# EAGLE design Lemming v3 (EAGLE 9.6.2)
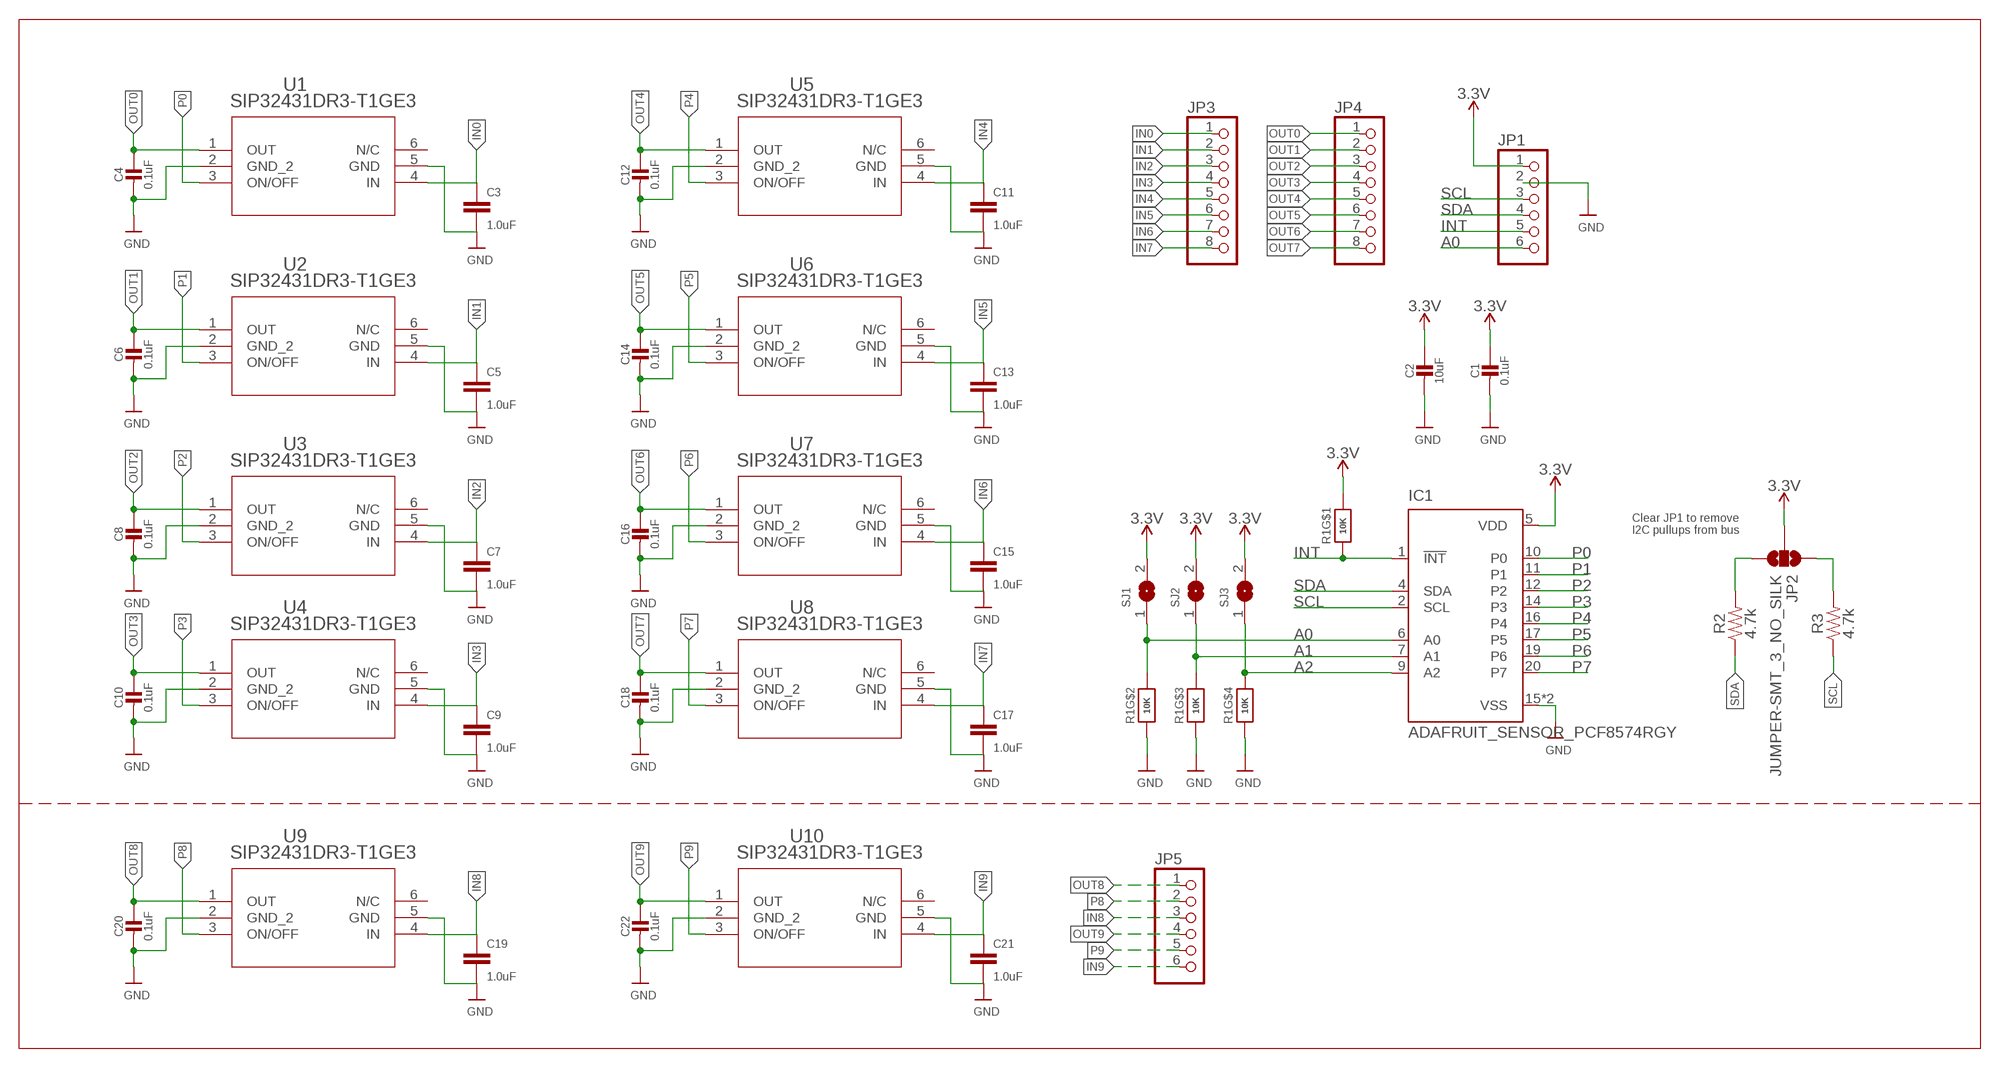
[diagram p0: schematic, sheet 1]

## Parts
C1  0.1uF  CAP_CERAMIC0603_NO  [0603-NO]
C2  10uF  CAP_CERAMIC0805-NOOUTLINE  [0805-NO]
C3  1.0uF  1.0UF-0603-16V-10%  [0603]
C4  0.1uF  CAP_CERAMIC0603_NO  [0603-NO]
C5  1.0uF  1.0UF-0603-16V-10%  [0603]
C6  0.1uF  CAP_CERAMIC0603_NO  [0603-NO]
C7  1.0uF  1.0UF-0603-16V-10%  [0603]
C8  0.1uF  CAP_CERAMIC0603_NO  [0603-NO]
C9  1.0uF  1.0UF-0603-16V-10%  [0603]
C10  0.1uF  CAP_CERAMIC0603_NO  [0603-NO]
C11  1.0uF  1.0UF-0603-16V-10%  [0603]
C12  0.1uF  CAP_CERAMIC0603_NO  [0603-NO]
C13  1.0uF  1.0UF-0603-16V-10%  [0603]
C14  0.1uF  CAP_CERAMIC0603_NO  [0603-NO]
C15  1.0uF  1.0UF-0603-16V-10%  [0603]
C16  0.1uF  CAP_CERAMIC0603_NO  [0603-NO]
C17  1.0uF  1.0UF-0603-16V-10%  [0603]
C18  0.1uF  CAP_CERAMIC0603_NO  [0603-NO]
C19  1.0uF  1.0UF-0603-16V-10%  [0603]
C20  0.1uF  CAP_CERAMIC0603_NO  [0603-NO]
C21  1.0uF  1.0UF-0603-16V-10%  [0603]
C22  0.1uF  CAP_CERAMIC0603_NO  [0603-NO]
IC1  ADAFRUIT_SENSOR_PCF8574RGY  [ADAFRUIT_SENSOR_VQFN20_3.5X4.5]
JP1  HEADER-1X670MIL  [1X06_ROUND_70]
JP2  JUMPER-SMT_3_NO_SILK  [SMT-JUMPER_3_NO_SILK]
JP3  PINHD-1X8BIG  [1X08-BIG]
JP4  PINHD-1X8BIG  [1X08-BIG]
JP5  HEADER-1X670MIL  [1X06_ROUND_70]
R1  10K  MICROBUILDER_RESISTOR_4PACK  [MICROBUILDER_RESPACK_4X0603]
R2  4.7k  4.7KOHM-0603-1/10W-1%  [0603]
R3  4.7k  4.7KOHM-0603-1/10W-1%  [0603]
SJ1  SOLDERJUMPER  [SOLDERJUMPER_ARROW_NOPASTE]
SJ2  SOLDERJUMPER  [SOLDERJUMPER_ARROW_NOPASTE]
SJ3  SOLDERJUMPER  [SOLDERJUMPER_ARROW_NOPASTE]
U1  SIP32431DR3-T1GE3  [SC-70-6_VIS]
U2  SIP32431DR3-T1GE3  [SC-70-6_VIS]
U3  SIP32431DR3-T1GE3  [SC-70-6_VIS]
U4  SIP32431DR3-T1GE3  [SC-70-6_VIS]
U5  SIP32431DR3-T1GE3  [SC-70-6_VIS]
U6  SIP32431DR3-T1GE3  [SC-70-6_VIS]
U7  SIP32431DR3-T1GE3  [SC-70-6_VIS]
U8  SIP32431DR3-T1GE3  [SC-70-6_VIS]
U9  SIP32431DR3-T1GE3  [SC-70-6_VIS]
U10  SIP32431DR3-T1GE3  [SC-70-6_VIS]

## Nets
3.3V: C1.1 C2.1 IC1.5(VDD) JP1.1 JP2.2 R1.8 SJ1.2 SJ2.2 SJ3.2
A0: IC1.6(A0) JP1.6 R1.7 SJ1.1
A1: IC1.7(A1) R1.6 SJ2.1
A2: IC1.9(A2) R1.5 SJ3.1
GND [highpower]: C1.2 C2.2 C3.2 C4.2 C5.2 C6.2 C7.2 C8.2 C9.2 C10.2 C11.2 C12.2 C13.2 C14.2 C15.2 C16.2 C17.2 C18.2 C19.2 C20.2 C21.2 C22.2 IC1.15(VSS) IC1.21(VSS) JP1.2 R1.2 R1.3 R1.4 U1.2(GND_2) U1.5(GND) U2.2(GND_2) U2.5(GND) U3.2(GND_2) U3.5(GND) U4.2(GND_2) U4.5(GND) U5.2(GND_2) U5.5(GND) U6.2(GND_2) U6.5(GND) U7.2(GND_2) U7.5(GND) U8.2(GND_2) U8.5(GND) U9.2(GND_2) U9.5(GND) U10.2(GND_2) U10.5(GND)
IN0: C3.1 JP3.1 U1.4(IN)
IN1: C5.1 JP3.2 U2.4(IN)
IN2: C7.1 JP3.3 U3.4(IN)
IN3: C9.1 JP3.4 U4.4(IN)
IN4: C11.1 JP3.5 U5.4(IN)
IN5: C13.1 JP3.6 U6.4(IN)
IN6: C15.1 JP3.7 U7.4(IN)
IN7: C17.1 JP3.8 U8.4(IN)
IN8: C19.1 JP5.3 U9.4(IN)
IN9: C21.1 JP5.6 U10.4(IN)
INT: IC1.1(!INT) JP1.5 R1.1
N$7: JP2.3 R2.2
N$8: JP2.1 R3.2
OUT0: C4.1 JP4.1 U1.1(OUT)
OUT1: C6.1 JP4.2 U2.1(OUT)
OUT2: C8.1 JP4.3 U3.1(OUT)
OUT3: C10.1 JP4.4 U4.1(OUT)
OUT4: C12.1 JP4.5 U5.1(OUT)
OUT5: C14.1 JP4.6 U6.1(OUT)
OUT6: C16.1 JP4.7 U7.1(OUT)
OUT7: C18.1 JP4.8 U8.1(OUT)
OUT8: C20.1 JP5.1 U9.1(OUT)
OUT9: C22.1 JP5.4 U10.1(OUT)
P0: IC1.10(P0) U1.3(ON/OFF)
P1: IC1.11(P1) U2.3(ON/OFF)
P2: IC1.12(P2) U3.3(ON/OFF)
P3: IC1.14(P3) U4.3(ON/OFF)
P4: IC1.16(P4) U5.3(ON/OFF)
P5: IC1.17(P5) U6.3(ON/OFF)
P6: IC1.19(P6) U7.3(ON/OFF)
P7: IC1.20(P7) U8.3(ON/OFF)
P8: JP5.2 U9.3(ON/OFF)
P9: JP5.5 U10.3(ON/OFF)
SCL: IC1.2(SCL) JP1.3 R3.1
SDA: IC1.4(SDA) JP1.4 R2.1
Unconnected: U1.6(N/C) U2.6(N/C) U3.6(N/C) U4.6(N/C) U5.6(N/C) U6.6(N/C) U7.6(N/C) U8.6(N/C) U9.6(N/C) U10.6(N/C)

## Notes on the sheet
- Clear JP1 to remove
  I2C pullups from bus

## Library data of the parts
C1 C2 C4 C6 C8 C10 C12 C14 C16 C18 C20 C22 = microbuilder:CAP_CERAMIC: Ceramic Capacitors For new designs, use the packages preceded by an '_' character since they are more reliable: The following footprints should be used on most boards: _0402 - Standard footprint for regular board layouts _0603 - Standard footprint for regular board layouts _0805 - Standard footprint for regular board layouts _1206 - Standard footprint for regular board layouts For extremely tight-pitch boards where space is at a premium, the following 'micro-pitch' footprints can be used (smaller pads, no silkscreen outline, etc.): _0402MP - Micro-pitch footprint for very dense/compact boards _0603MP - Micro-pitch footprint for very dense/compact boards _0805MP - Micro-pitch footprint for very dense/compact boards _1206MP - Micro-pitch footprint for very dense/compact boards
C3 C5 C7 C9 C11 C13 C15 C17 C19 C21 = SparkFun-Capacitors:1.0UF: 1µF ceramic capacitors A capacitor is a passive two-terminal electrical component used to store electrical energy temporarily in an electric field.; PROD_ID: CAP-00868
IC1 = Lemming v3:ADAFRUIT_SENSOR_PCF8574: I2C-Bus Remote 8-bit I/O expander http://www.semiconductors.philips.com/acrobat_download/datasheets/PCF8574_4.pdf
JP1 JP5 = microbuilder:HEADER-1X6: PIN HEADER
JP2 = SparkFun-Jumpers:JUMPER-SMT_3_NO: Normally open jumper This jumper has three pads in close proximity to each other. Apply solder to close the connection(s).
JP3 JP4 = adafruit:PINHD-1X8: PIN HEADER
R1 = Lemming v3:MICROBUILDER_RESISTOR_4PACK: Resistor Packs (4 resistors) 4 x 0603 10K 1/16W - Digikey: YC164J-10KCT-ND
R2 R3 = SparkFun-Resistors:4.7KOHM: 4.7kΩ resistor A resistor is a passive two-terminal electrical component that implements electrical resistance as a circuit element. Resistors act to reduce current flow, and, at the same time, act to lower voltage levels within circuits. - Wikipedia; PROD_ID: RES-07857
SJ1-SJ3 = microbuilder:SOLDERJUMPER: SMD Solder JUMPER Solder the two pads together to create a connection, or remove the solder to break it. REFLOW - Use this footprint for solder paste and reflow ovens. WAVE - Use this footprint for hand-soldering (larger pads). CLOSED - Has a trace between the two pads to ensure it is closed by default. The trace needs to be cut to disable the jumper, and can be closed again by creating a solder bridge between the two pads.; BOM: EXCLUDE
U1-U10 = Switch:SIP32431DR3-T1GE3; COPYRIGHT: Copyright (C) 2022 Ultra Librarian. All rights reserved.; MANUFACTURER_PART_NUMBER: SIP32431DR3-T1GE3; MFR_NAME: Vishay

## Net classes
1 highpower: width 0.305 mm, drill 0.483 mm

## Board
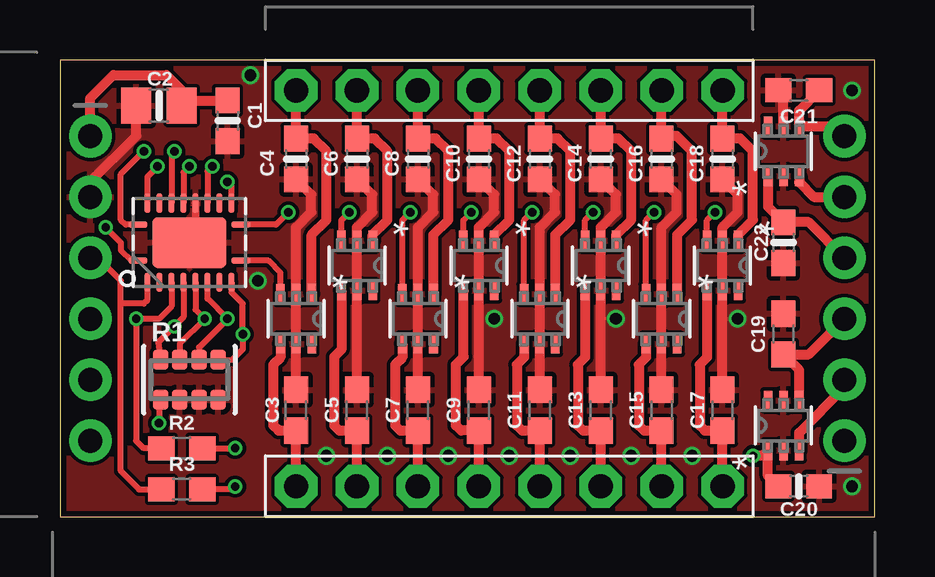
[diagram p1: board, top side]
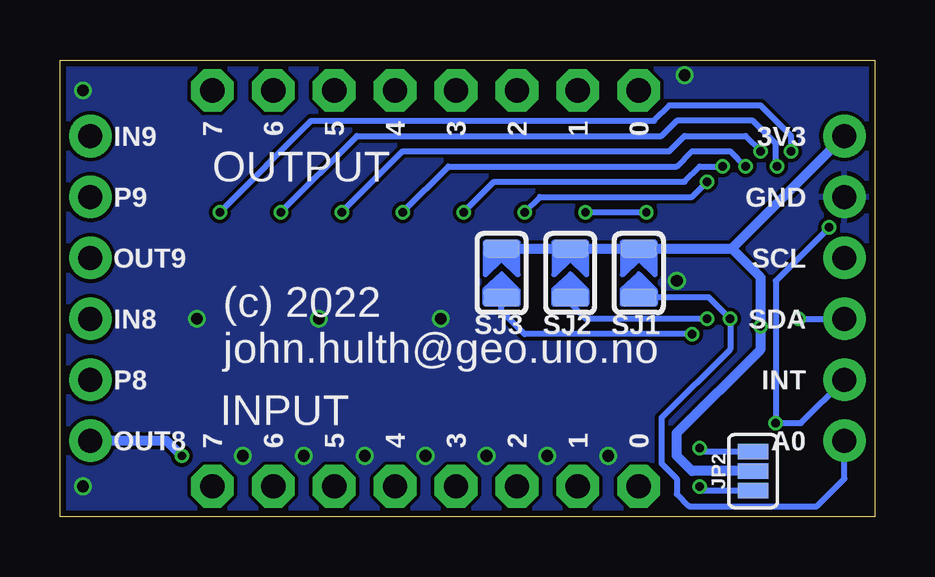
[diagram p2: board, bottom side, seen from below]

Size 33.97 x 19.05 mm. Coordinates in mm from the lower left corner, seen from the top.
Outline: 0,0 33.97,0 33.97,19.05 0,19.05 0,0
Copper layers (1*16): Top 0.018mm / dielectric 1.55mm / Bottom 0.018mm
Design rules "eC_2Layer_PClass6_BaseCopperO18_eCDefault": minimum track width 0.15mm, minimum drill 0.35mm, track to track 0.15mm, track to pad 0.15mm, pad to pad 0.15mm, via to via 0.15mm, smd to smd 0mil, copper to edge 0.25mm, drill to drill 0.35mm, minimum pad ring 0.175mm, minimum via ring 0.125mm, stop-mask expansion 0mil, vias tented up to drill 0.45mm, thermal gap 0.2mm

### Footprints (pad centres in the part's own frame; a part is rotated, then mirrored left to right if it is on the bottom)
0603-NO = smd 1.075 x 1: 1 -0.85,0; 2 0.85,0
0805-NO = smd 1.24 x 1.5: 1 -0.95,0; 2 0.95,0
0603 = smd 1.1 x 1: 1 -0.85,0; 2 0.85,0
ADAFRUIT_SENSOR_VQFN20_3.5X4.5 = smd 0.26 x 0.79: 1 -0.75,2.15; 10 -0.75,-2.15; 11 0.75,-2.15; 20 0.75,2.15 | smd 0.79 x 0.26: 2 -1.65,1.75; 3 -1.65,1.25; 4 -1.65,0.75; 5 -1.65,0.25; 6 -1.65,-0.25; 7 -1.65,-0.75; 8 -1.65,-1.25; 9 -1.65,-1.75; 12 1.65,-1.75; 13 1.65,-1.25; 14 1.65,-0.75; 15 1.65,-0.25; 16 1.65,0.25; 17 1.65,0.75; 18 1.65,1.25; 19 1.65,1.75 | smd 2.1 x 3.1: 21 0,0
1X06_ROUND_70 = drill 1 pad 1.778: 1 -6.35,0; 2 -3.81,0; 3 -1.27,0; 4 1.27,0; 5 3.81,0; 6 6.35,0
SMT-JUMPER_3_NO_SILK = smd 0.635 x 1.27: 1 -0.813,0; 2 0,0; 3 0.813,0
1X08-BIG = drill 1.016 pad 1.778 octagon: 1 -8.89,0; 2 -6.35,0; 3 -3.81,0; 4 -1.27,0; 5 1.27,0; 6 3.81,0; 7 6.35,0; 8 8.89,0
MICROBUILDER_RESPACK_4X0603 = smd 0.65 x 0.85: 1 -1.2,-0.835; 2 -0.4,-0.835; 3 0.4,-0.835; 4 1.2,-0.835; 5 1.2,0.835; 6 0.4,0.835; 7 -0.4,0.835; 8 -1.2,0.835
SOLDERJUMPER_ARROW_NOPASTE = smd 0.762 x 1.524: 1 -1.016,0; 2 1.016,0
SC-70-6_VIS = smd 0.813 x 0.356: 1 -1.041,0.65; 2 -1.041,0; 3 -1.041,-0.65; 4 1.041,-0.65; 5 1.041,0; 6 1.041,0.65

### Placement (x,y rotation side)
C1  6.99,16.51 270 top
C2  4.13,17.14 180 top
C3  9.84,4.45 90 top
C4  9.84,14.92 270 top
C5  12.38,4.45 90 top
C6  12.38,14.92 270 top
C7  14.92,4.45 90 top
C8  14.92,14.92 270 top
C9  17.46,4.45 90 top
C10  17.46,14.92 270 top
C11  20,4.45 90 top
C12  20,14.92 270 top
C13  22.54,4.45 90 top
C14  22.54,14.92 270 top
C15  25.08,4.45 90 top
C16  25.08,14.92 270 top
C17  27.62,4.45 90 top
C18  27.62,14.92 270 top
C19  30.16,7.62 90 top
C20  30.8,1.27 0 top
C21  30.8,17.78 180 top
C22  30.16,11.43 270 top
IC1  5.4,11.43 90 top
JP1  1.27,9.53 270 top
JP2  5.08,1.91 90 bottom
JP3  18.73,1.27 0 top
JP4  18.73,17.78 0 top
JP5  32.7,9.53 90 top
R1  5.4,5.71 0 top
R2  5.08,2.86 0 top
R3  5.08,1.14 0 top
SJ1  9.84,10.16 90 bottom
SJ2  12.7,10.16 90 bottom
SJ3  15.56,10.16 90 bottom
U1  9.84,8.26 270 top
U2  12.38,10.48 270 top
U3  14.92,8.26 270 top
U4  17.46,10.48 270 top
U5  20,8.26 270 top
U6  22.54,10.48 270 top
U7  25.08,8.26 270 top
U8  27.62,10.48 270 top
U9  30.16,3.81 90 top
U10  30.16,15.24 90 top

### Tracks (layer width: path | path; a pad name or v marks a point on that pad's centre or on a via)
3.3V  (via drill 0.35)
  Top 0.254: IC1.5 5.15,8.32 v4.76,7.94 4.1,7.27 R1.8
  Top 0.406: C2.1 5.29,17.36 | 5.29,17.36 C1.1 | JP1.1 1.27,17.46 2.22,18.41 4.45,18.41 5.29,17.57 5.29,17.36
  Bottom 0.406: JP2.2 7.62,1.91 8.26,2.54 8.26,3.49 4.76,6.99 v4.76,7.94 4.76,9.97 5.97,11.18 | SJ3.2 SJ2.2 SJ1.2 5.97,11.18 | 5.97,11.18 JP1.1
A0  (via drill 0.35)
  Top 0.254: IC1.6 5.65,8.64 v6.03,8.26 5,7.22 R1.7
  Bottom 0.254: SJ1.1 6.92,9.14 v6.03,8.26 6.03,6.99 8.89,4.13 8.89,2.22 8.26,1.59 8.26,0.95 7.74,0.44 2.42,0.44 1.27,1.59 JP1.6
A1  (via drill 0.35)
  Top 0.254: R1.6 5.8,7.07 v6.99,8.26 6.15,9.09 IC1.7
  Bottom 0.254: v6.99,8.26 12.06,8.26 12.7,8.89 SJ2.1
A2  (via drill 0.35)
  Top 0.254: IC1.9 7.15,9.36 7.62,8.89 v7.62,7.62 7.62,6.99 7.2,6.57 R1.5
  Bottom 0.254: v7.62,7.62 14.61,7.62 15.56,8.57 SJ3.1
GND  (via drill 0.48)
  Top 0.305: IC1.15 5.65,11.68 IC1.21
  Top 0.406: C10.2 18.1,13.44 18.1,12.7 17.46,12.06 U4.2 U4.5 C9.2 | C14.2 23.18,13.44 23.18,12.7 22.54,12.06 U6.2 U6.5 C13.2 | C18.2 28.26,13.44 28.26,12.7 27.62,12.06 U8.2 U8.5 C17.2 | C6.2 13.02,13.44 13.02,12.7 12.38,12.06 U2.2 U2.5 C5.2 | C15.2 U7.5 U7.2 25.08,12.06 25.72,12.7 25.72,13.44 C16.2 | C11.2 U5.5 U5.2 20,12.06 20.64,12.7 20.64,13.44 C12.2 | C7.2 U3.5 U3.2 14.92,12.06 15.56,12.7 15.56,13.44 C8.2 | C3.2 U1.5 U1.2 9.84,12.06 10.48,12.7 10.48,13.44 C4.2 | JP1.2 1.27,13.97 3.18,15.88 C2.2 | U10.5 30.16,17.57 C21.2
  other vias: 8.26,9.84 11.11,2.54 13.65,2.54 16.19,2.54 18.73,2.54 21.27,2.54 23.81,2.54 26.35,2.54 33.02,17.78 7.94,18.41 23.18,8.26 18.1,8.26 28.26,8.26 33.02,1.27
  pour Top: 0,0 0,19.68 33.97,19.68 33.97,0
  pour Bottom: 0,0 0,19.37 33.97,19.37 33.97,0
IN0
  Top 0.406: JP3.1 C3.1 9.11,3.6 8.89,3.81 8.89,6.35 9.19,6.65 U1.4
IN1
  Top 0.406: JP3.2 C5.1 11.64,3.6 11.43,3.81 11.43,6.67 11.73,6.97 U2.4
IN2
  Top 0.406: U3.4 14.27,6.65 13.97,6.35 13.97,3.81 14.19,3.6 C7.1 JP3.3
IN3
  Top 0.406: U4.4 16.83,9.42 16.83,6.67 16.51,6.35 16.51,3.81 16.73,3.6 C9.1 JP3.4
IN4
  Top 0.406: U5.4 19.35,6.65 19.05,6.35 19.05,3.81 19.27,3.6 C11.1 JP3.5
IN5
  Top 0.406: U6.4 21.89,6.65 21.59,6.35 21.59,3.81 21.8,3.6 C13.1 JP3.6
IN6
  Top 0.406: JP3.7 C15.1 24.34,3.6 24.13,3.81 24.13,6.35 24.43,6.65 U7.4
IN7
  Top 0.406: JP3.8 C17.1 26.89,3.6 26.67,3.81 26.67,6.35 26.97,6.65 U8.4
IN8
  Top 0.406: U9.4 30.81,6.12 C19.1 31.22,6.77 JP5.3
IN9
  Top 0.406: JP5.6 32.3,16.28 U10.4 30.81,16.95 C21.1
INT  (via drill 0.35)
  Top 0.254: v1.91,12.06 2.54,11.43 2.54,11.11 2.97,10.68 IC1.1 | R1.1 4.13,4.83 v4.13,3.91
  Bottom 0.254: v1.91,12.06 4.13,9.84 v4.13,3.91 3.08,3.91 JP1.5
N$7  (via drill 0.35)
  Top 0.254: R2.2 v7.3,2.86
  Bottom 0.254: v7.3,2.86 7.16,2.72 JP2.3
N$8  (via drill 0.35)
  Top 0.254: v7.3,1.25 7.19,1.14 R3.2
  Bottom 0.254: v7.3,1.25 7.14,1.09 JP2.1
OUT0
  Top 0.406: U1.1 10.49,11.76 11.11,12.38 11.11,15.24 10.58,15.77 C4.1 JP4.1
OUT1
  Top 0.406: JP4.2 C6.1 13.12,15.77 13.65,15.24 13.65,12.38 13.03,11.76 U2.1
OUT2
  Top 0.406: U3.1 15.57,11.76 16.19,12.38 16.19,15.24 15.66,15.77 C8.1 JP4.3
OUT3
  Top 0.406: U4.1 18.11,11.76 18.73,12.38 18.73,15.24 18.2,15.77 C10.1 JP4.4
OUT4
  Top 0.406: U5.1 20.65,11.76 21.27,12.38 21.27,15.24 20.74,15.77 C12.1 JP4.5
OUT5
  Top 0.406: U6.1 23.19,11.76 23.81,12.38 23.81,15.24 23.28,15.77 C14.1 JP4.6
OUT6
  Top 0.406: C16.1 25.08,15.88 | 25.08,15.88 JP4.7 | U7.1 25.73,11.76 26.35,12.38 26.35,15.24 25.72,15.88 25.08,15.88
OUT7
  Top 0.406: JP4.8 C18.1 28.36,15.77 28.89,15.24 28.89,12.38 28.27,11.76 U8.1
OUT8  (via drill 0.35)
  Top 0.406: C20.1 29.51,1.71 U9.1 29.28,2.54 v28.89,2.54
  Bottom 0.406: v28.89,2.54 29.53,3.17 JP5.1
OUT9
  Top 0.406: U10.1 29.51,12.93 C22.1 31.22,12.28 JP5.4
P0
  Top 0.254: U1.3 9.19,10.18 8.69,10.68 IC1.10
P1  (via drill 0.35)
  Top 0.254: U2.3 11.73,12.37 v12.06,12.7 | v9.53,12.7 9.01,12.18 IC1.11
  Bottom 0.254: v12.06,12.7 v9.53,12.7
P2  (via drill 0.35)
  Top 0.254: U3.3 14.27,12.37 v14.61,12.7 | IC1.12 7.15,13.81 v6.99,13.97
  Bottom 0.254: v14.61,12.7 13.97,13.34 7.62,13.34 v6.99,13.97
P3  (via drill 0.35)
  Top 0.254: U4.3 16.81,12.37 v17.14,12.7 | v6.35,14.61 6.15,14.4 IC1.14
  Bottom 0.254: v17.14,12.7 15.88,13.97 7.94,13.97 7.3,14.61 v6.35,14.61
P4  (via drill 0.35)
  Top 0.254: U5.3 19.35,12.37 v19.68,12.7 | v5.4,14.61 5.15,14.36 IC1.16
  Bottom 0.254: v19.68,12.7 17.78,14.61 8.26,14.61 7.62,15.24 6.03,15.24 v5.4,14.61
P5  (via drill 0.35)
  Top 0.254: U6.3 21.89,12.37 v22.23,12.7 | v4.76,15.24 4.65,15.12 IC1.17
  Bottom 0.254: v22.23,12.7 19.68,15.24 8.57,15.24 7.94,15.88 5.4,15.88 v4.76,15.24
P6  (via drill 0.35)
  Top 0.254: U7.3 24.43,12.37 v24.77,12.7 | IC1.19 3.65,14.18 v4.07,14.61
  Bottom 0.254: v24.77,12.7 21.59,15.88 8.89,15.88 8.26,16.51 5.08,16.51 4.13,15.56 4.13,14.66 v4.07,14.61
P7  (via drill 0.35)
  Top 0.254: U8.3 26.97,12.37 v27.3,12.7 | IC1.20 2.74,12.18 2.54,12.38 2.54,14.29 v3.49,15.24
  Bottom 0.254: v27.3,12.7 23.5,16.51 9.21,16.51 8.57,17.14 4.76,17.14 3.49,15.88 v3.49,15.24
P8
  Top 0.406: U9.3 30.81,3.51 32.7,5.4 JP5.2
P9
  Top 0.406: U10.3 30.81,13.96 31.43,13.34 JP5.5
SCL
  Top 0.254: JP1.3 1.59,10.79 2.54,9.84 2.54,8.89 | IC1.2 3.65,9.04 3.49,8.89 2.54,8.89 | 2.54,8.89 2.54,1.91 3.3,1.14 R3.1
SDA  (via drill 0.35)
  Top 0.254: IC1.4 4.65,8.78 4.13,8.26 v3.17,8.26 3.17,3.17 3.49,2.86 R2.1
  Bottom 0.254: v3.17,8.26 JP1.4

### Text on the board
bPlace: 3V3 | 0 | 1 | 2 | 3 | 4 | 5 | 6 | 7 | IN9 | OUTPUT | GND | P9 | SCL | OUT9 | SDA | IN8 | INT | (c) 2022 / john.hulth@geo.uio.no | P8 | INPUT | A0 | 0 | 1 | 2 | 3 | 4 | 5 | 6 | 7 | OUT8